# Altium schematic sheet DWM.SchDoc
size A
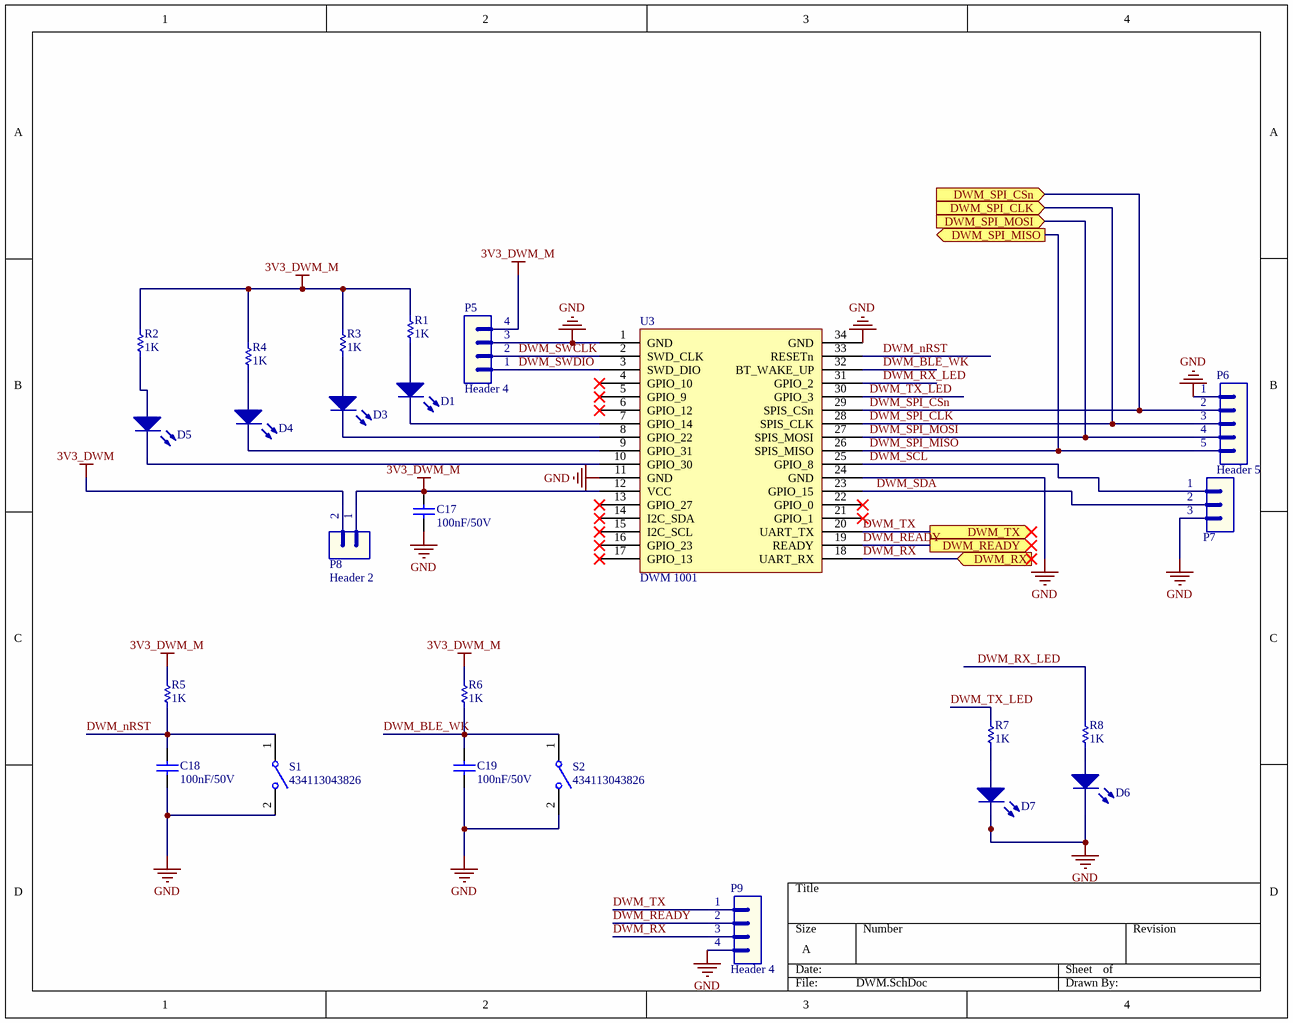
[diagram p0: DWM.SchDoc]

## Parts
C17  value 100nF/50V  [CAP-SM-0805]  (hidden comment: Cap-100nF-50V-0805)
C18  value 100nF/50V  [CAP-SM-0805]  (hidden comment: Cap-100nF-50V-0805)
C19  value 100nF/50V  [CAP-SM-0805]  (hidden comment: Cap-100nF-50V-0805)
D1  LED  [LED_0805_Blue]  (value not drawn)
D3  LED  [LED_0805_Blue]  (value not drawn)
D4  LED  [LED_0805_Blue]  (value not drawn)
D5  LED  [LED_0805_Blue]  (value not drawn)
D6  LED  [LED_0805_Blue]  (value not drawn)
D7  LED  [LED_0805_Blue]  (value not drawn)
P5  Header 4  [JP4]
P6  Header 5  [JP5]
P7  Header 3  [JP3]  (value not drawn)
P8  Header 2  [JP2]
P9  Header 4  [JP4]
R1  value 1K  [RES-SM-0805]  (hidden comment: Resistor 1/4W)
R2  value 1K  [RES-SM-0805]  (hidden comment: Resistor 1/4W)
R3  value 1K  [RES-SM-0805]  (hidden comment: Resistor 1/4W)
R4  value 1K  [RES-SM-0805]  (hidden comment: Resistor 1/4W)
R5  value 1K  [RES-SM-0805]  (hidden comment: Resistor 1/4W)
R6  value 1K  [RES-SM-0805]  (hidden comment: Resistor 1/4W)
R7  value 1K  [RES-SM-0805]  (hidden comment: Resistor 1/4W)
R8  value 1K  [RES-SM-0805]  (hidden comment: Resistor 1/4W)
S1  434113043826  [434113043826]
S2  434113043826  [434113043826]
U3  DWM 1001  [PCBComponent_1]

## Ports
DWM_READY (out), DWM_RX (in), DWM_SPI_CLK (in), DWM_SPI_CSn (in), DWM_SPI_MISO (out), DWM_SPI_MOSI (in), DWM_TX (out)

## Nets
3V3_DWM: P8.2
3V3_DWM_M: C17.2 P5.4 P8.1 R1.2 R2.2 R3.2 R4.2 R5.2 R6.2 U3.12(VCC)
GND: C17.1 C18.1 C19.1 D6.2(K) D7.2(K) P5.3 P6.1 P7.3 P9.4 S1.2 S2.2 U3.1(GND) U3.11(GND) U3.24(GND) U3.34(GND)
DWM_BLE_WK: C19.2 R6.1 S2.1 U3.32(BT_WAKE_UP)
DWM_nRST: C18.2 R5.1 S1.1 U3.33(RESETn)
DWM_READY: P9.2 U3.19(READY) ; port DWM_READY
DWM_RX: P9.3 U3.18(UART_RX) ; port DWM_RX
DWM_RX_LED: R8.2 U3.31(GPIO_2)
DWM_SCL: P7.1 U3.25(GPIO_8)
DWM_SDA: P7.2 U3.23(GPIO_15)
DWM_SPI_CLK: P6.3 U3.28(SPIS_CLK) ; port DWM_SPI_CLK
DWM_SPI_CSn: P6.2 U3.29(SPIS_CSn) ; port DWM_SPI_CSn
DWM_SPI_MISO: P6.5 U3.26(SPIS_MISO) ; port DWM_SPI_MISO
DWM_SPI_MOSI: P6.4 U3.27(SPIS_MOSI) ; port DWM_SPI_MOSI
DWM_SWCLK: P5.2 U3.2(SWD_CLK)
DWM_SWDIO: P5.1 U3.3(SWD_DIO)
DWM_TX: P9.1 U3.20(UART_TX) ; port DWM_TX
DWM_TX_LED: R7.2 U3.30(GPIO_3)
NetD1_1: D1.1(A) R1.1
NetD1_2: D1.2(K) U3.7(GPIO_14)
NetD3_1: D3.1(A) R3.1
NetD3_2: D3.2(K) U3.8(GPIO_22)
NetD4_1: D4.1(A) R4.1
NetD4_2: D4.2(K) U3.9(GPIO_31)
NetD5_1: D5.1(A) R2.1
NetD5_2: D5.2(K) U3.10(GPIO_30)
NetD6_1: D6.1(A) R8.1
NetD7_1: D7.1(A) R7.1

Not connected (* = marked no-connect by the designer): U3 4(GPIO_10)* 5(GPIO_9)* 6(GPIO_12)* 13(GPIO_27)* 14(I2C_SDA)* 15(I2C_SCL)* 16(GPIO_23)* 17(GPIO_13)* 21(GPIO_1)* 22(GPIO_0)*

## Library data of the parts
C17-C19 = Cap-100nF-50V-0805: CAP CER 0.1UF 50V Y5V 0805; Manufacturer: Samsung Electro-Mechanics; Manufacturer Part Number: CL21F104ZBCNNNC; Local Supplier: thegioiic; Local Supplier Link: https://thegioiic.com/products/tu-100nf-0-1uf-50v-0805; Supplier 1: Digikey; Supplier 1 Part Number: 1276-1007-1-ND; Supplier 1 Link: https://www.digikey.com/product-detail/en/samsung-electro-mechanics/CL21F104ZBCNNNC/1276-1007-1-ND/3889093
P5 P9 = Header 4: Header, 4-Pin; LatestRevisionDate: 17-Jul-2002; LatestRevisionNote: Re-released for DXP Platform.; Publisher: Altium Limited
P6 = Header 5: Header, 5-Pin; LatestRevisionDate: 17-Jul-2002; LatestRevisionNote: Re-released for DXP Platform.; Publisher: Altium Limited
P7 = Header 3: Header, 3-Pin; LatestRevisionDate: 17-Jul-2002; LatestRevisionNote: Re-released for DXP Platform.; Publisher: Altium Limited
P8 = Header 2: Header, 2-Pin; LatestRevisionDate: 17-Jul-2002; LatestRevisionNote: Re-released for DXP Platform.; Publisher: Altium Limited
R1-R8 = RES
S1 S2 = 434113043826: WS-TASV J-Bend SMT Tact Switch 6x3.5mm, height 4.3mm, 260gf; Rated Voltage: 12VDC; Rated Current: 50mA; Washable: No; ComponentLink1Description: Manufacturer; ComponentLink1URL: http://www.we-online.de; ComponentLink2Description: Datasheet; ComponentLink2URL: https://katalog.we-online.com/em/datasheet/434113043826.pdf; Operating Temperature: -40 to +85degC; Part Number: 434113043826; Published Date: September 2019; Contact Material: Stainless Steel; Height: 4.3mm; Mounting Technology: SMT; Contact Plating: Silver; Operation Force: 260gf; Packaging: Tape and Reel; Terminal Material: Copper Alloy; Publisher: Wurth Elektronik; Terminal Plating: Silver